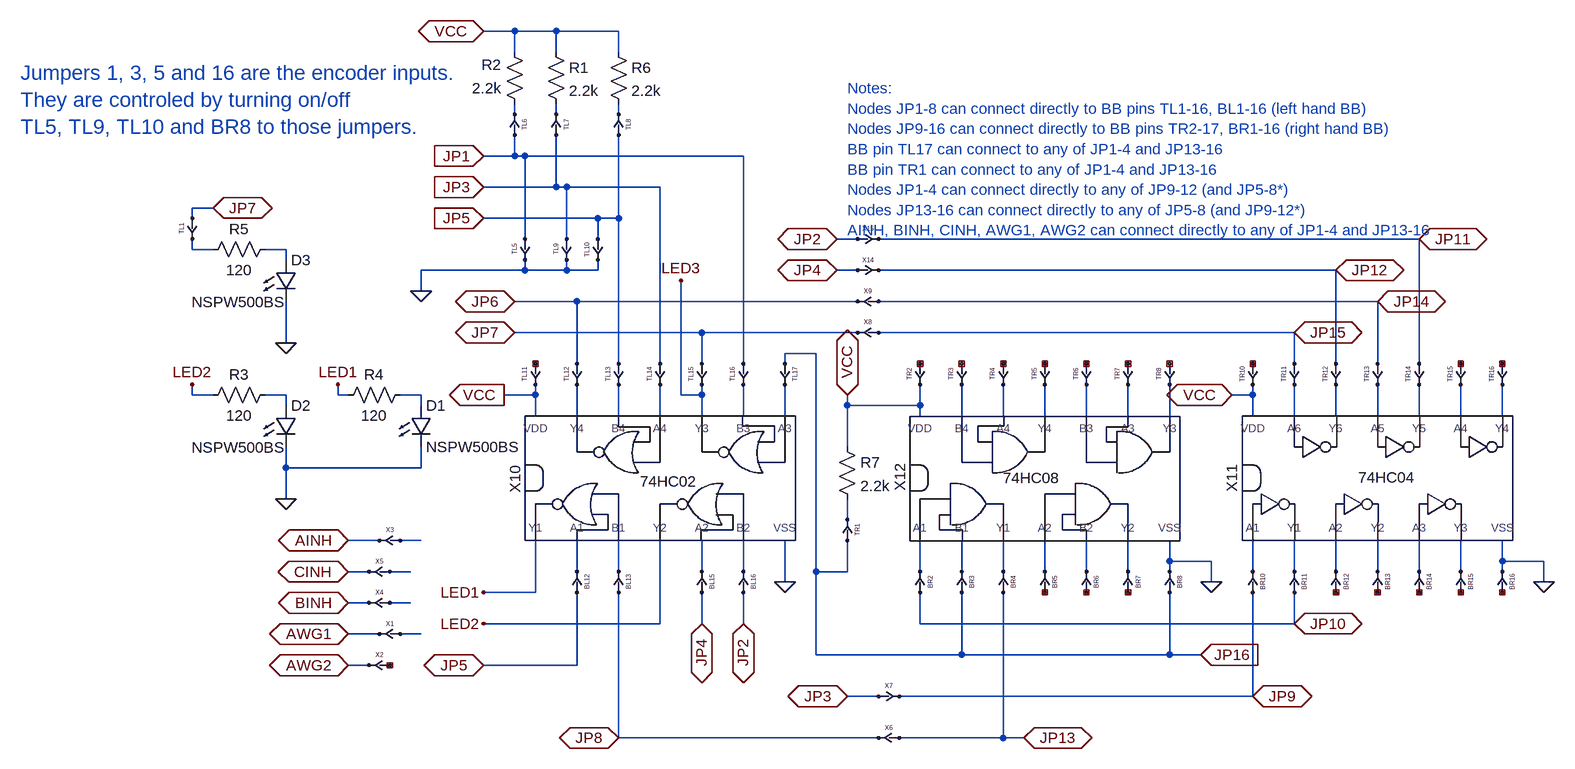
[diagram p0: schematic priority-encoder-nor-4-2.asc]
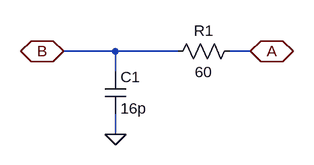
[diagram p1: sub-circuit cross_point.asc]
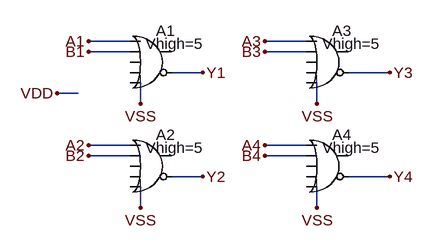
[diagram p2: sub-circuit 74hc02.asc]
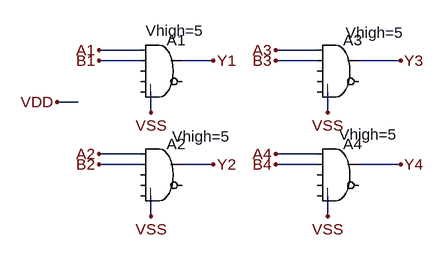
[diagram p3: sub-circuit 74hc08.asc]
priority-encoder-nor-4-2.asc, the LTspice schematic file:
Version 4
SHEET 1 2532 968
WIRE 32 -528 -16 -528
WIRE 96 -528 32 -528
WIRE 192 -528 96 -528
WIRE 32 -496 32 -528
WIRE 96 -496 96 -528
WIRE 192 -496 192 -528
WIRE 32 -400 32 -416
WIRE 96 -400 96 -416
WIRE 192 -400 192 -416
WIRE 32 -336 32 -368
WIRE 32 -336 -16 -336
WIRE 48 -336 32 -336
WIRE 384 -336 48 -336
WIRE 96 -288 96 -368
WIRE 96 -288 -16 -288
WIRE 112 -288 96 -288
WIRE 256 -288 112 -288
WIRE -432 -256 -464 -256
WIRE -464 -240 -464 -256
WIRE 160 -240 -16 -240
WIRE 192 -240 192 -368
WIRE 192 -240 160 -240
WIRE 48 -208 48 -336
WIRE 112 -208 112 -288
WIRE 160 -208 160 -240
WIRE 560 -208 528 -208
WIRE 1424 -208 592 -208
WIRE -464 -192 -464 -208
WIRE -432 -192 -464 -192
WIRE -320 -192 -352 -192
WIRE -320 -176 -320 -192
WIRE 48 -160 48 -176
WIRE 48 -160 -112 -160
WIRE 112 -160 112 -176
WIRE 112 -160 48 -160
WIRE 160 -160 160 -176
WIRE 160 -160 112 -160
WIRE 560 -160 528 -160
WIRE 1296 -160 592 -160
WIRE -112 -128 -112 -160
WIRE 128 -112 32 -112
WIRE 560 -112 128 -112
WIRE 1360 -112 592 -112
WIRE 320 -64 32 -64
WIRE 560 -64 320 -64
WIRE 1232 -64 592 -64
WIRE -320 -48 -320 -112
WIRE 496 -32 448 -32
WIRE 128 -16 128 -112
WIRE 192 -16 192 -240
WIRE 256 -16 256 -288
WIRE 320 -16 320 -64
WIRE 384 -16 384 -336
WIRE 448 -16 448 -32
WIRE 1232 -16 1232 -64
WIRE 1296 -16 1296 -160
WIRE 1360 -16 1360 -112
WIRE 1424 -16 1424 -208
WIRE -464 32 -464 16
WIRE -432 32 -464 32
WIRE -320 32 -352 32
WIRE -240 32 -240 16
WIRE -224 32 -240 32
WIRE -112 32 -144 32
WIRE 64 32 64 16
WIRE 64 32 16 32
WIRE 288 32 288 -144
WIRE 320 32 320 16
WIRE 320 32 288 32
WIRE 1168 32 1168 16
WIRE 1168 32 1136 32
WIRE -320 48 -320 32
WIRE -112 48 -112 32
WIRE 544 48 544 32
WIRE 656 48 656 16
WIRE 656 48 544 48
WIRE 64 64 64 32
WIRE 128 64 128 16
WIRE 192 64 192 16
WIRE 256 64 256 16
WIRE 320 64 320 32
WIRE 384 64 384 16
WIRE 448 64 448 16
WIRE 656 64 656 48
WIRE 720 64 720 16
WIRE 784 64 784 16
WIRE 848 64 848 16
WIRE 912 64 912 16
WIRE 976 64 976 16
WIRE 1040 64 1040 16
WIRE 1168 64 1168 32
WIRE 1232 64 1232 16
WIRE 1296 64 1296 16
WIRE 1360 64 1360 16
WIRE 1424 64 1424 16
WIRE 1488 64 1488 16
WIRE 1552 64 1552 16
WIRE 544 112 544 48
WIRE -320 144 -320 112
WIRE -112 144 -112 112
WIRE -112 144 -320 144
WIRE -320 192 -320 144
WIRE 544 224 544 192
WIRE -176 256 -224 256
WIRE -112 256 -144 256
WIRE 1040 288 1040 256
WIRE 1104 288 1040 288
WIRE 1552 288 1552 256
WIRE 1616 288 1552 288
WIRE -192 304 -224 304
WIRE -128 304 -160 304
WIRE 128 304 128 256
WIRE 192 304 192 256
WIRE 320 304 320 256
WIRE 384 304 384 256
WIRE 496 304 496 -32
WIRE 544 304 544 256
WIRE 544 304 496 304
WIRE 656 304 656 256
WIRE 720 304 720 256
WIRE 784 304 784 256
WIRE 848 304 848 256
WIRE 912 304 912 256
WIRE 976 304 976 256
WIRE 1040 304 1040 288
WIRE 1168 304 1168 256
WIRE 1232 304 1232 256
WIRE 1296 304 1296 256
WIRE 1360 304 1360 256
WIRE 1424 304 1424 256
WIRE 1488 304 1488 256
WIRE 1552 304 1552 288
WIRE 448 320 448 256
WIRE 1104 320 1104 288
WIRE 1616 320 1616 288
WIRE 64 336 64 256
WIRE 64 336 -16 336
WIRE -192 352 -224 352
WIRE -128 352 -160 352
WIRE 256 384 256 256
WIRE 256 384 -16 384
WIRE 320 384 320 336
WIRE 384 384 384 336
WIRE 656 384 656 336
WIRE 1232 384 1232 336
WIRE 1232 384 656 384
WIRE -176 400 -224 400
WIRE -112 400 -144 400
WIRE 496 432 496 304
WIRE 720 432 720 336
WIRE 720 432 496 432
WIRE 1040 432 1040 336
WIRE 1040 432 720 432
WIRE 1088 432 1040 432
WIRE -192 448 -224 448
WIRE 128 448 128 336
WIRE 128 448 -16 448
WIRE 592 496 544 496
WIRE 1168 496 1168 336
WIRE 1168 496 624 496
WIRE 192 560 192 336
WIRE 592 560 192 560
WIRE 784 560 784 336
WIRE 784 560 624 560
WIRE 816 560 784 560
FLAG -224 400 AWG1
IOPIN -224 400 BiDir
FLAG -224 448 AWG2
IOPIN -224 448 BiDir
FLAG 16 32 VCC
IOPIN 16 32 Out
FLAG 448 320 0
FLAG 192 560 JP8
IOPIN 192 560 BiDir
FLAG -224 256 AINH
IOPIN -224 256 BiDir
FLAG -224 352 BINH
IOPIN -224 352 BiDir
FLAG 544 496 JP3
IOPIN 544 496 BiDir
FLAG -224 304 CINH
IOPIN -224 304 BiDir
FLAG 32 -112 JP6
IOPIN 32 -112 BiDir
FLAG 1136 32 VCC
IOPIN 1136 32 BiDir
FLAG 1616 320 0
FLAG 544 32 VCC
IOPIN 544 32 BiDir
FLAG 1360 -112 JP14
IOPIN 1360 -112 BiDir
FLAG 1104 320 0
FLAG 1232 -64 JP15
IOPIN 1232 -64 BiDir
FLAG 1168 496 JP9
IOPIN 1168 496 BiDir
FLAG 816 560 JP13
IOPIN 816 560 BiDir
FLAG -432 -256 JP7
IOPIN -432 -256 BiDir
FLAG -16 -240 JP5
IOPIN -16 -240 In
FLAG 1296 -160 JP12
IOPIN 1296 -160 BiDir
FLAG 1424 -208 JP11
IOPIN 1424 -208 BiDir
FLAG -320 192 0
FLAG 1088 432 JP16
IOPIN 1088 432 In
FLAG 528 -160 JP4
IOPIN 528 -160 BiDir
FLAG 32 -64 JP7
IOPIN 32 -64 BiDir
FLAG -16 -336 JP1
IOPIN -16 -336 In
FLAG 528 -208 JP2
IOPIN 528 -208 BiDir
FLAG 384 384 JP2
IOPIN 384 384 BiDir
FLAG -16 -288 JP3
IOPIN -16 -288 In
FLAG -16 448 JP5
IOPIN -16 448 BiDir
FLAG 320 384 JP4
IOPIN 320 384 BiDir
FLAG 1232 384 JP10
IOPIN 1232 384 BiDir
FLAG -16 336 LED1
FLAG -16 384 LED2
FLAG 288 -144 LED3
FLAG -320 -48 0
FLAG -240 16 LED1
FLAG -464 16 LED2
FLAG -16 -528 VCC
IOPIN -16 -528 BiDir
FLAG -112 -128 0
SYMBOL cross_point 128 320 R90
SYMATTR InstName BL12
SYMBOL cross_point 192 320 R90
SYMATTR InstName BL13
SYMBOL cross_point 320 320 R90
SYMATTR InstName BL15
SYMBOL cross_point 384 320 R90
SYMATTR InstName BL16
SYMBOL cross_point 384 0 R270
SYMATTR InstName TL16
SYMBOL cross_point 320 0 R270
SYMATTR InstName TL15
SYMBOL cross_point 256 0 R270
SYMATTR InstName TL14
SYMBOL cross_point 192 0 R270
SYMATTR InstName TL13
SYMBOL cross_point 128 0 R270
SYMATTR InstName TL12
SYMBOL cross_point 64 0 R270
SYMATTR InstName TL11
SYMBOL cross_point -160 400 R0
SYMATTR InstName X1
SYMBOL cross_point -176 448 R0
SYMATTR InstName X2
SYMBOL cross_point -160 256 R0
SYMATTR InstName X3
SYMBOL cross_point -176 352 R0
SYMATTR InstName X4
SYMBOL cross_point -176 304 R0
SYMATTR InstName X5
SYMBOL cross_point 656 0 R270
SYMATTR InstName TR2
SYMBOL cross_point 720 0 R270
SYMATTR InstName TR3
SYMBOL cross_point 784 0 R270
SYMATTR InstName TR4
SYMBOL cross_point 848 0 R270
SYMATTR InstName TR5
SYMBOL cross_point 912 0 R270
SYMATTR InstName TR6
SYMBOL cross_point 976 0 R270
SYMATTR InstName TR7
SYMBOL cross_point 1040 0 R270
SYMATTR InstName TR8
SYMBOL cross_point 656 320 R90
SYMATTR InstName BR2
SYMBOL cross_point 720 320 R90
SYMATTR InstName BR3
SYMBOL cross_point 784 320 R90
SYMATTR InstName BR4
SYMBOL cross_point 848 320 R90
SYMATTR InstName BR5
SYMBOL cross_point 912 320 R90
SYMATTR InstName BR6
SYMBOL cross_point 976 320 R90
SYMATTR InstName BR7
SYMBOL cross_point 1040 320 R90
SYMATTR InstName BR8
SYMBOL cross_point 608 560 R0
SYMATTR InstName X6
SYMBOL cross_point 608 496 M0
SYMATTR InstName X7
SYMBOL res 80 -512 R0
SYMATTR InstName R1
SYMATTR Value 2.2k
SYMBOL cross_point 96 -384 R90
SYMATTR InstName TL7
SYMBOL res 48 -400 R180
WINDOW 0 36 76 Left 2
WINDOW 3 36 40 Left 2
SYMATTR InstName R2
SYMATTR Value 2.2k
SYMBOL cross_point 32 -384 R90
SYMATTR InstName TL6
SYMBOL LED -128 48 R0
SYMATTR InstName D1
SYMATTR Value NSPW500BS
SYMBOL LED -336 48 R0
WINDOW 3 -129 65 Left 2
SYMATTR Value NSPW500BS
SYMATTR InstName D2
SYMBOL res -336 16 R90
WINDOW 0 0 56 VBottom 2
WINDOW 3 32 56 VTop 2
SYMATTR InstName R3
SYMATTR Value 120
SYMBOL res -128 16 R90
WINDOW 0 0 56 VBottom 2
WINDOW 3 32 56 VTop 2
SYMATTR InstName R4
SYMATTR Value 120
SYMBOL 74hc02 256 160 R0
SYMATTR InstName X10
SYMBOL 74hc04 1376 160 R0
SYMATTR InstName X11
SYMBOL 74hc08 864 160 R0
SYMATTR InstName X12
SYMBOL cross_point 448 0 M270
SYMATTR InstName TL17
SYMBOL cross_point 576 -64 R0
SYMATTR InstName X8
SYMBOL cross_point 576 -112 R0
SYMATTR InstName X9
SYMBOL cross_point 576 -160 M0
SYMATTR InstName X14
SYMBOL cross_point 576 -208 M0
SYMATTR InstName X15
SYMBOL LED -336 -176 R0
WINDOW 3 -129 65 Left 2
SYMATTR Value NSPW500BS
SYMATTR InstName D3
SYMBOL res -336 -208 R90
WINDOW 0 0 56 VBottom 2
WINDOW 3 32 56 VTop 2
SYMATTR InstName R5
SYMATTR Value 120
SYMBOL res 176 -512 R0
SYMATTR InstName R6
SYMATTR Value 2.2k
SYMBOL cross_point 192 -384 R90
SYMATTR InstName TL8
SYMBOL cross_point 48 -192 R270
SYMATTR InstName TL5
SYMBOL cross_point 112 -192 R270
SYMATTR InstName TL9
SYMBOL cross_point 160 -192 R270
SYMATTR InstName TL10
SYMBOL res 528 96 R0
SYMATTR InstName R7
SYMATTR Value 2.2k
SYMBOL cross_point -464 -224 R270
SYMATTR InstName TL1
SYMBOL cross_point 544 240 R90
SYMATTR InstName TR1
SYMBOL cross_point 1168 0 R270
SYMATTR InstName TR10
SYMBOL cross_point 1232 0 R270
SYMATTR InstName TR11
SYMBOL cross_point 1296 0 R270
SYMATTR InstName TR12
SYMBOL cross_point 1360 0 R270
SYMATTR InstName TR13
SYMBOL cross_point 1424 0 R270
SYMATTR InstName TR14
SYMBOL cross_point 1488 0 R270
SYMATTR InstName TR15
SYMBOL cross_point 1552 0 R270
SYMATTR InstName TR16
SYMBOL cross_point 1168 320 R90
SYMATTR InstName BR10
SYMBOL cross_point 1232 320 R90
SYMATTR InstName BR11
SYMBOL cross_point 1296 320 R90
SYMATTR InstName BR12
SYMBOL cross_point 1360 320 R90
SYMATTR InstName BR13
SYMBOL cross_point 1424 320 R90
SYMATTR InstName BR14
SYMBOL cross_point 1488 320 R90
SYMATTR InstName BR15
SYMBOL cross_point 1552 320 R90
SYMATTR InstName BR16
TEXT 544 -440 Left 2 ;Notes:\nNodes JP1-8 can connect directly to BB pins TL1-16, BL1-16 (left hand BB)\nNodes JP9-16 can connect directly to BB pins TR2-17, BR1-16 (right hand BB)\nBB pin TL17 can connect to any of JP1-4 and JP13-16\nBB pin TR1 can connect to any of JP1-4 and JP13-16\nNodes JP1-4 can connect directly to any of JP9-12 (and JP5-8*)\nNodes JP13-16 can connect directly to any of JP5-8 (and JP9-12*)\nAINH, BINH, CINH, AWG1, AWG2 can connect directly to any of JP1-4 and JP13-16
TEXT -728 -464 Left 3 ;Jumpers 1, 3, 5 and 16 are the encoder inputs.\nThey are controled by turning on/off \nTL5, TL9, TL10 and BR8 to those jumpers.

cross_point.asc, the sub-circuit schematic file:
Version 4
SHEET 1 880 680
WIRE 80 160 0 160
WIRE 176 160 80 160
WIRE 288 160 256 160
WIRE 80 192 80 160
WIRE 80 288 80 256
FLAG 288 160 A
IOPIN 288 160 BiDir
FLAG 0 160 B
IOPIN 0 160 BiDir
FLAG 80 288 0
SYMBOL res 272 144 R90
WINDOW 0 0 56 VBottom 2
WINDOW 3 32 56 VTop 2
SYMATTR InstName R1
SYMATTR Value 60
SYMBOL cap 64 192 R0
SYMATTR InstName C1
SYMATTR Value 16p

74hc02.asc, the sub-circuit schematic file:
Version 4
SHEET 1 1612 680
WIRE 256 0 192 0
WIRE 528 0 464 0
WIRE 256 16 192 16
WIRE 528 16 464 16
WIRE 368 48 320 48
WIRE 656 48 592 48
WIRE 176 80 144 80
WIRE 272 96 272 64
WIRE 544 96 544 64
WIRE 256 160 192 160
WIRE 528 160 464 160
WIRE 256 176 192 176
WIRE 528 176 464 176
WIRE 368 208 320 208
WIRE 656 208 592 208
WIRE 272 256 272 224
WIRE 544 256 544 224
FLAG 368 48 Y1
FLAG 368 208 Y2
FLAG 656 48 Y3
FLAG 656 208 Y4
FLAG 192 0 A1
FLAG 192 160 A2
FLAG 464 0 A3
FLAG 464 160 A4
FLAG 192 16 B1
FLAG 192 176 B2
FLAG 464 16 B3
FLAG 464 176 B4
FLAG 272 96 VSS
FLAG 544 96 VSS
FLAG 544 256 VSS
FLAG 272 256 VSS
FLAG 144 80 VDD
SYMBOL Digital\\or 288 -32 R0
WINDOW 3 -8 36 Left 2
SYMATTR Value Vhigh=5
SYMATTR InstName A1
SYMBOL Digital\\or 288 128 R0
WINDOW 3 -8 36 Left 2
SYMATTR Value Vhigh=5
SYMATTR InstName A2
SYMBOL Digital\\or 560 -32 R0
WINDOW 3 -8 36 Left 2
SYMATTR Value Vhigh=5
SYMATTR InstName A3
SYMBOL Digital\\or 560 128 R0
WINDOW 3 -8 36 Left 2
SYMATTR Value Vhigh=5
SYMATTR InstName A4

74hc08.asc, the sub-circuit schematic file:
Version 4
SHEET 1 1612 680
WIRE 256 0 192 0
WIRE 528 0 464 0
WIRE 256 16 192 16
WIRE 368 16 320 16
WIRE 528 16 464 16
WIRE 656 16 592 16
WIRE 160 80 128 80
WIRE 272 96 272 64
WIRE 544 96 544 64
WIRE 256 160 192 160
WIRE 528 160 464 160
WIRE 256 176 192 176
WIRE 368 176 320 176
WIRE 528 176 464 176
WIRE 656 176 592 176
WIRE 272 256 272 224
WIRE 544 256 544 224
FLAG 368 16 Y1
FLAG 368 176 Y2
FLAG 656 16 Y3
FLAG 656 176 Y4
FLAG 192 0 A1
FLAG 192 160 A2
FLAG 464 0 A3
FLAG 464 160 A4
FLAG 192 16 B1
FLAG 192 176 B2
FLAG 464 16 B3
FLAG 464 176 B4
FLAG 272 96 VSS
FLAG 544 96 VSS
FLAG 544 256 VSS
FLAG 272 256 VSS
FLAG 128 80 VDD
SYMBOL Digital\\and 288 -32 R0
WINDOW 3 -24 2 Left 2
SYMATTR Value Vhigh=5
SYMATTR InstName A1
SYMBOL Digital\\and 288 128 R0
WINDOW 3 17 5 Left 2
SYMATTR Value Vhigh=5
SYMATTR InstName A2
SYMBOL Digital\\and 560 -32 R0
WINDOW 3 12 5 Left 2
SYMATTR Value Vhigh=5
SYMATTR InstName A3
SYMBOL Digital\\and 560 128 R0
WINDOW 3 2 2 Left 2
SYMATTR Value Vhigh=5
SYMATTR InstName A4

The netlist it stands for:
* priority-encoder-nor-4-2.asc
XBL12 JP5 N028 cross_point
XBL13 JP8 N029 cross_point
XBL15 JP4 N030 cross_point
XBL16 JP2 N031 cross_point
XTL16 JP1 N011 cross_point
XTL15 JP7 LED3 cross_point
XTL14 JP3 N010 cross_point
XTL13 JP5 N009 cross_point
XTL12 JP6 N008 cross_point
XTL11 NC_01 VCC cross_point
XX1 N045 AWG1 cross_point
XX2 NC_02 AWG2 cross_point
XX3 N026 AINH cross_point
XX4 N044 BINH cross_point
XX5 N027 CINH cross_point
XTR2 NC_03 VCC cross_point
XTR3 NC_04 N013 cross_point
XTR4 NC_05 N014 cross_point
XTR5 NC_06 N015 cross_point
XTR6 NC_07 N016 cross_point
XTR7 NC_08 N017 cross_point
XTR8 NC_09 N018 cross_point
XBR2 JP10 N032 cross_point
XBR3 JP16 N033 cross_point
XBR4 JP13 N034 cross_point
XBR5 NC_10 N035 cross_point
XBR6 NC_11 N036 cross_point
XBR7 NC_12 N037 cross_point
XBR8 JP16 0 cross_point
XX6 JP13 JP8 cross_point
XX7 JP3 JP9 cross_point
R1 VCC N002 2.2k
XTL7 JP3 N002 cross_point
R2 N001 VCC 2.2k
XTL6 JP1 N001 cross_point
D1 N007 0 NSPW500BS
D2 N006 0 NSPW500BS
R3 N006 LED2 120
R4 N007 LED1 120
XX10 N028 N029 LED1 N030 N031 LED2 0 N008 N009 N010 LED3 N011 N012 VCC 74hc02 params: 74HC02
XX11 N038 N039 N040 N041 N042 N043 0 N024 N023 N022 N021 N020 N019 VCC 74HC04  ; pins A1 Y1 A2 Y2 A3 Y3 VSS Y4 A4 Y5 A5 Y6 A6 VDD
XX12 N032 N033 N034 N035 N036 N037 0 N018 N017 N016 N015 N014 N013 VCC 74hc08 params: 74HC08
XTL17 JP16 N012 cross_point
XX8 JP15 JP7 cross_point
XX9 JP14 JP6 cross_point
XX14 JP4 JP12 cross_point
XX15 JP2 JP11 cross_point
D3 N005 0 NSPW500BS
R5 N005 N004 120
R6 VCC N003 2.2k
XTL8 JP5 N003 cross_point
XTL5 JP1 0 cross_point
XTL9 JP3 0 cross_point
XTL10 JP5 0 cross_point
R7 VCC N025 2.2k
XTL1 JP7 N004 cross_point
XTR1 JP16 N025 cross_point
XTR10 NC_13 VCC cross_point
XTR11 JP15 N019 cross_point
XTR12 JP12 N020 cross_point
XTR13 JP14 N021 cross_point
XTR14 JP11 N022 cross_point
XTR15 NC_14 N023 cross_point
XTR16 NC_15 N024 cross_point
XBR10 JP9 N038 cross_point
XBR11 JP10 N039 cross_point
XBR12 NC_16 N040 cross_point
XBR13 NC_17 N041 cross_point
XBR14 NC_18 N042 cross_point
XBR15 NC_19 N043 cross_point
XBR16 NC_20 0 cross_point

* block symbol definitions
.subckt cross_point A B
R1 A B 60
C1 B 0 16p
.ends cross_point

.subckt 74hc02 A1 B1 Y1 A2 B2 Y2 VSS Y4 B4 A4 Y3 B3 A3 VDD
A1 A1 B1 VSS VSS VSS Y1 VSS VSS OR Vhigh=5
A2 A2 B2 VSS VSS VSS Y2 VSS VSS OR Vhigh=5
A3 A3 B3 VSS VSS VSS Y3 VSS VSS OR Vhigh=5
A4 A4 B4 VSS VSS VSS Y4 VSS VSS OR Vhigh=5
.ends 74hc02

.subckt 74hc08 A1 B1 Y1 A2 B2 Y2 VSS Y3 A3 B3 Y4 A4 B4 VDD
A1 A1 B1 VSS VSS VSS VSS Y1 VSS AND Vhigh=5
A2 A2 B2 VSS VSS VSS VSS Y2 VSS AND Vhigh=5
A3 A3 B3 VSS VSS VSS VSS Y3 VSS AND Vhigh=5
A4 A4 B4 VSS VSS VSS VSS Y4 VSS AND Vhigh=5
.ends 74hc08

.model D D
.lib standard.dio
* Notes:
* Nodes JP1-8 can connect directly to BB pins TL1-16, BL1-16 (left hand BB)
* Nodes JP9-16 can connect directly to BB pins TR2-17, BR1-16 (right hand BB)
* BB pin TL17 can connect to any of JP1-4 and JP13-16
* BB pin TR1 can connect to any of JP1-4 and JP13-16
* Nodes JP1-4 can connect directly to any of JP9-12 (and JP5-8*)
* Nodes JP13-16 can connect directly to any of JP5-8 (and JP9-12*)
* AINH, BINH, CINH, AWG1, AWG2 can connect directly to any of JP1-4 and JP13-16
* Jumpers 1, 3, 5 and 16 are the encoder inputs.
* They are controled by turning on/off
* TL5, TL9, TL10 and BR8 to those jumpers.
.backanno
.end